# EAGLE design tamiya_camrobo_face_xiao (EAGLE 9.1.3)
CNAME: BotaLab; CREVISION: 1.0; DESIGNER: botamochi6277
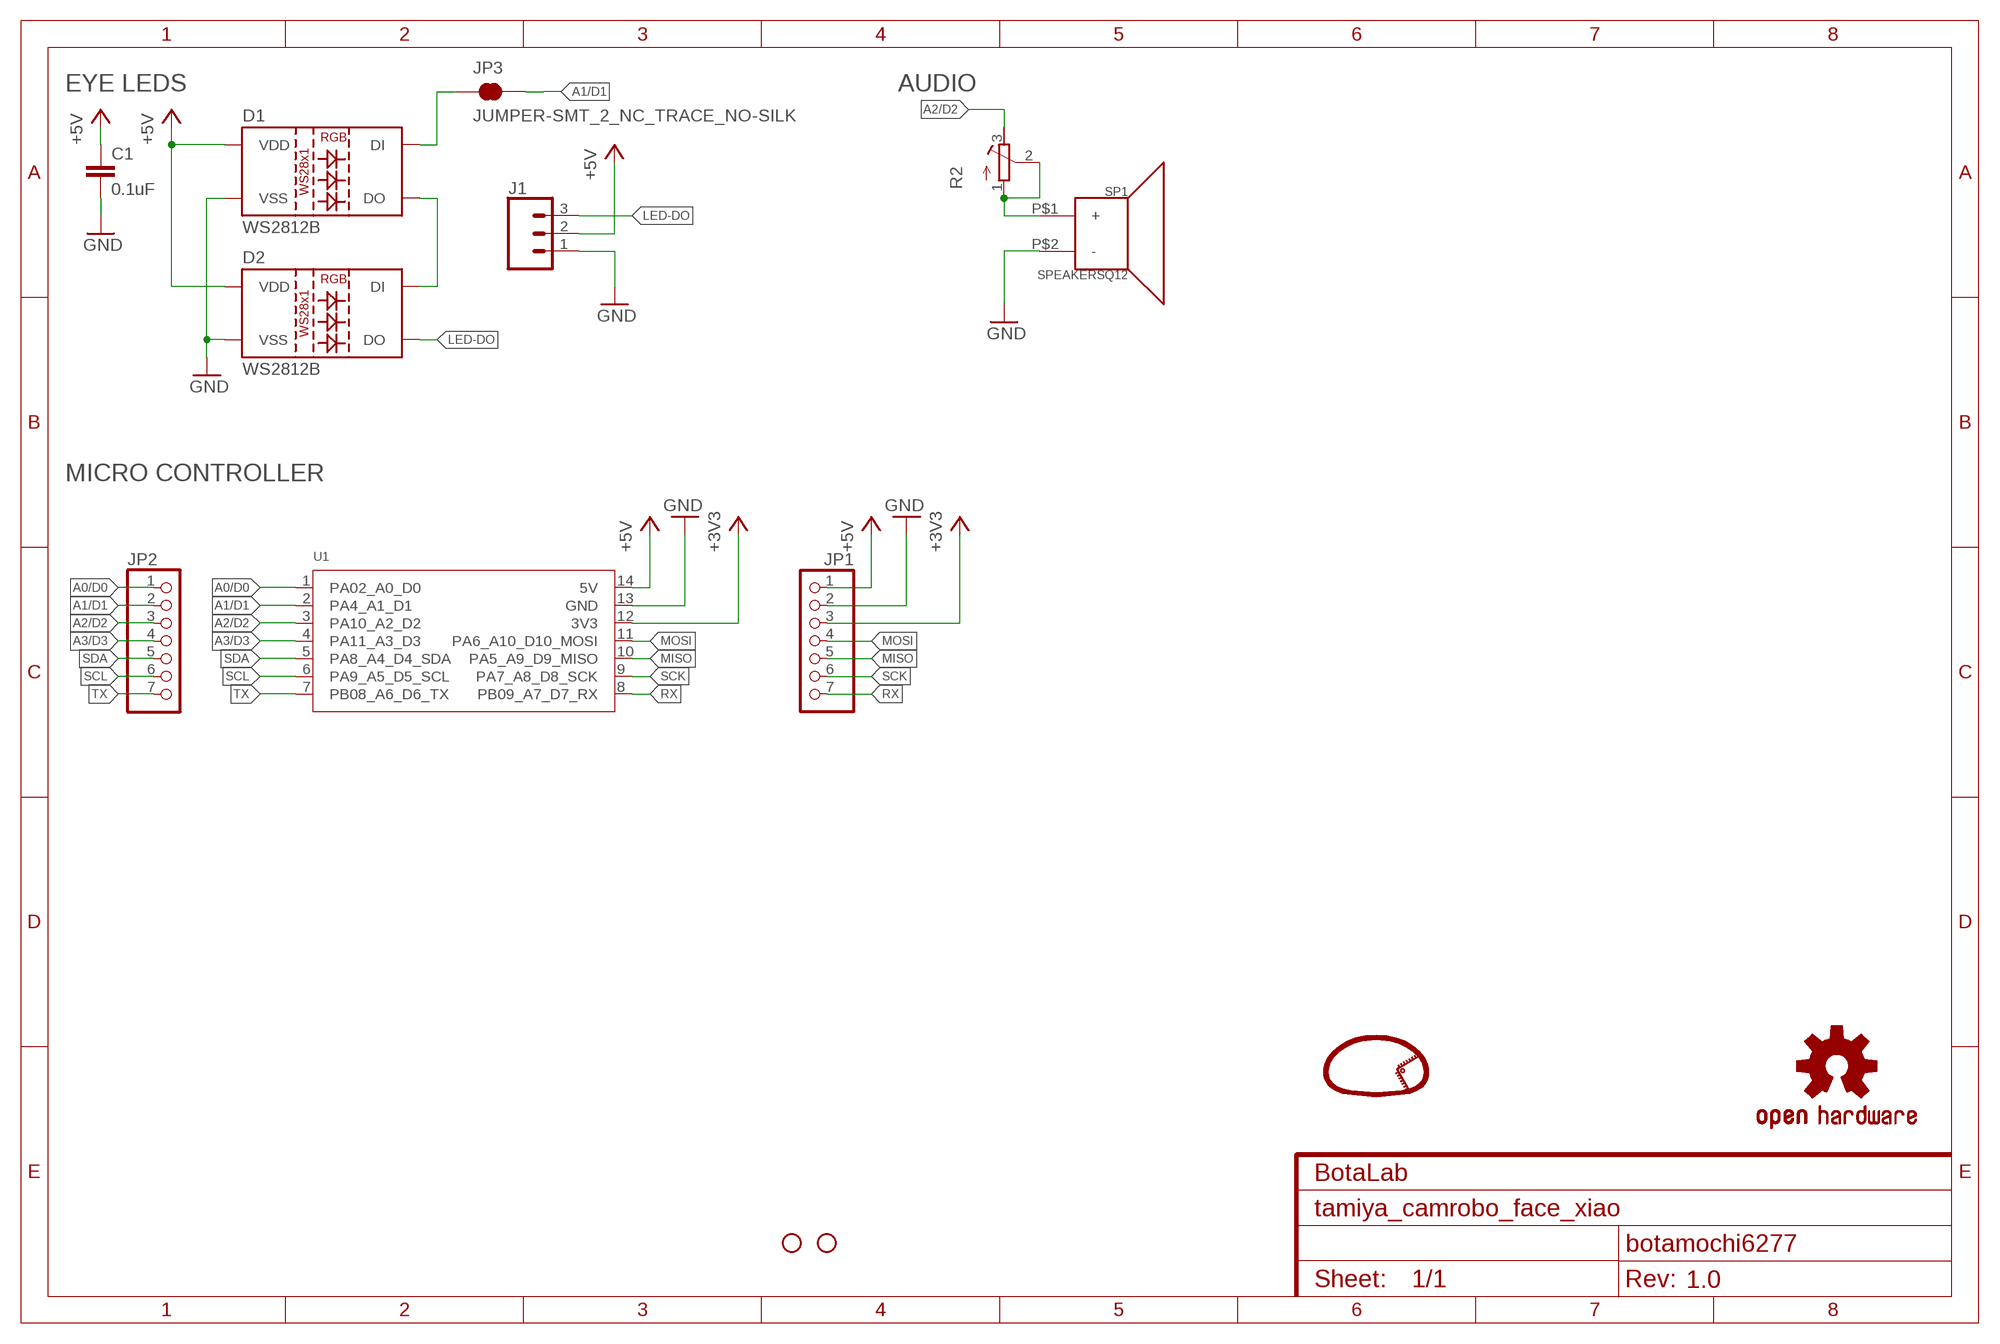
[diagram p0: schematic, sheet 1]

## Parts
C1  0.1uF  C-EUC1608  [C1608]
D1  WS2812B  [WS2812B]
D2  WS2812B  [WS2812B]
H1  STAND-OFF  [STAND-OFF]
H2  STAND-OFF  [STAND-OFF]
J1  CONN_03  [1X03]
JP1  PINHD-1X7  [1X07]
JP2  PINHD-1X7  [1X07]
JP3  JUMPER-SMT_2_NC_TRACE_NO-SILK  [SMT-JUMPER_2_NC_TRACE_NO-SILK]
LOGO1  LOGO  [LOGO]
LOGO2  OSHW-LOGOS  [OSHW-LOGO-S]
R2  R-TRIMMCVR42A  [RTRIMCVR42A]
SP1  SPEAKERSQ12  [PKLCS1212E]
U1  MOUDLE-SEEEDUINO-XIAO-MOUNTED  [MOUDLE14P-2.54-21X17.8MM-MODIFIED]

## Nets
+3V3 [pwr]: JP1.3 U1.12(3V3)
+5V [pwr]: C1.1 D1.1(VDD) D2.1(VDD) J1.2 JP1.1 U1.14(5V)
A0/D0: JP2.1 U1.1(PA02_A0_D0)
A1/D1: JP2.2 JP3.2 U1.2(PA4_A1_D1)
A2/D2: JP2.3 R2.3(E) U1.3(PA10_A2_D2)
A3/D3: JP2.4 U1.4(PA11_A3_D3)
GND [pwr]: C1.2 D1.3(VSS) D2.3(VSS) J1.1 JP1.2 SP1.P$2(-) U1.13(GND)
LED-DO: D2.2(DO) J1.3
MISO: JP1.5 U1.10(PA5_A9_D9_MISO)
MOSI: JP1.4 U1.11(PA6_A10_D10_MOSI)
N$1: D1.2(DO) D2.4(DI)
N$2: R2.1(A) R2.2(S) SP1.P$1(+)
N$3: D1.4(DI) JP3.1
RX: JP1.7 U1.8(PB09_A7_D7_RX)
SCK: JP1.6 U1.9(PA7_A8_D8_SCK)
SCL: JP2.6 U1.6(PA9_A5_D5_SCL)
SDA: JP2.5 U1.5(PA8_A4_D4_SDA)
TX: JP2.7 U1.7(PB08_A6_D6_TX)

## Notes on the sheet
- EYE LEDS | AUDIO
- MICRO CONTROLLER

## Library data of the parts
C1 = rcl:C-EU: CAPACITOR, European symbol; SPICEPREFIX: C
D1 D2 = SparkFun-LED:WS2812B: WS2812B SMD addressable RGB LED 5x5mm SMD LED with built-in controller IC. Color: Red/Green/Blue mC Rating: RGB: 390, 660, 180 mcd Forward Voltage: RGB: 2.0, 3.0, 3.0 V Packages:WS2812B SparkFun Products: Blynk Board - ESP8266 <https://www.sparkfun.com/products/13794>; PROD_ID: DIO-12503
H1 H2 = SparkFun-Hardware:STAND-OFF: Stand Off Drill holes for mechanically mounting via screws, standoffs, etc. Note: Use the keepout ring to avoid running the screw head into surrounding components. Variant Overviews STAND-OFF - Mechanical footprint for a #4 phillips button head screw. STAND-OFF-TIGHT - Mechanical footprint for a #4 phillips button head screw, Example SparkFun Products Screw - Phillips Head (1/4", 4-40, 10 pack) <https://www.sparkfun.com/products/10453> (PRT-10453) Screw - Phillips Head (1/2", 4-40, 10 pack) <https://www.sparkfun.com/products/10452> (PRT-10452) Screw - Phillips Head (3/4", 4-40, 10 pack) <https://www.sparkfun.com/products/10451> (PRT-10451) Screw - Phillips Head (1", 4-40, 10 pack) <https://www.sparkfun.com/products/10450> (PRT-10450)
J1 = SparkFun-Connectors:CONN_03: Multi connection point. Often used as Generic Header-pin footprint for 0.1 inch spaced/style header connections On any of the 0.1 inch spaced packages, you can populate with these: Break Away Headers - Straight <https://www.sparkfun.com/products/116> (PRT-00116) Break Away Male Headers - Right Angle <https://www.sparkfun.com/products/553> (PRT-00553) Female Headers <https://www.sparkfun.com/products/115> (PRT-00115) Break Away Headers - Machine Pin <https://www.sparkfun.com/products/117> (PRT-00117) Break Away Female Headers - Swiss Machine Pin <https://www.sparkfun.com/products/743> (PRT-00743) Stackable Header - 3 Pin (Female, 0.1") <https://www.sparkfun.com/products/13875> (PRT-13875) For SCREWTERMINALS and SPRING TERMINALS visit here: Screw Terimnals on SparkFun.com <https://www.sparkfun.com/search/results?term=Screw+Terminals> (5mm/3.5mm/2.54mm spacing) This device is also useful as a general connection point to wire up your design to another part of your project. Our various solder wires solder well into these plated through hole pads. Hook-Up Wire - Assortment (Stranded, 22 AWG) <https://www.sparkfun.com/products/11375> (PRT-11375) Hook-Up Wire - Assortment (Solid Core, 22 AWG) <https://www.sparkfun.com/products/11367> (PRT-11367) View the entire wire category on our website here <https://www.sparkfun.com/categories/141> Special notes: Molex polarized connector foot print use with SKU : PRT-08232 with associated crimp pins and housings.
JP1 JP2 = pinhead:PINHD-1X7: PIN HEADER
JP3 = SparkFun-Jumpers:JUMPER-SMT_2_NC_TRACE: Normally closed trace jumper This jumper has a trace between two pads so it's normally closed (NC). Use a razor knife to open the connection. For best results follow the IPC guidelines for cutting traces: Cutout at least 0.063 mm (0.005 in). Remove all loose material to clean up the cut area. Seal the cut with an approved epoxy. Reapply solder to reclose the connection.
LOGO1 = botamochi-symbol:LOGO
LOGO2 = SparkFun-Aesthetics:OSHW-LOGO: Open-Source Hardware (OSHW) Logo This logo indicates the piece of hardware it is found on incorporates a OSHW license and/or adheres to the definition of open source hardware found here: http://freedomdefined.org/OSHW
R2 = rcl:R-TRIMM: Trimm resistor; SPICEMODEL: X; SPICEPREFIXL: POT
SP1 = Botamochi-sensors:SPEAKER
U1 = Seeeduino XIAO:MOUDLE-SEEEDUINO-XIAO

## Net classes
1 pwr: width 0.5 mm

## Board
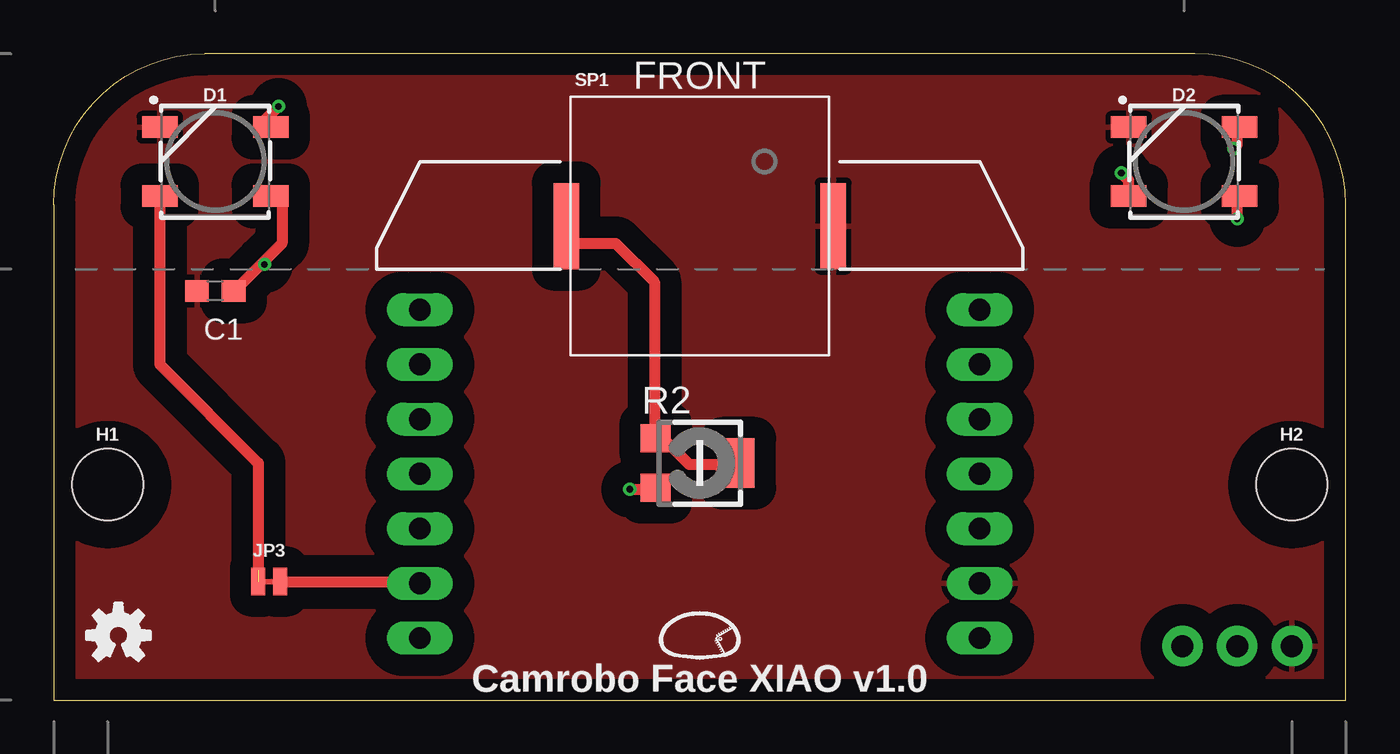
[diagram p1: board, top side]
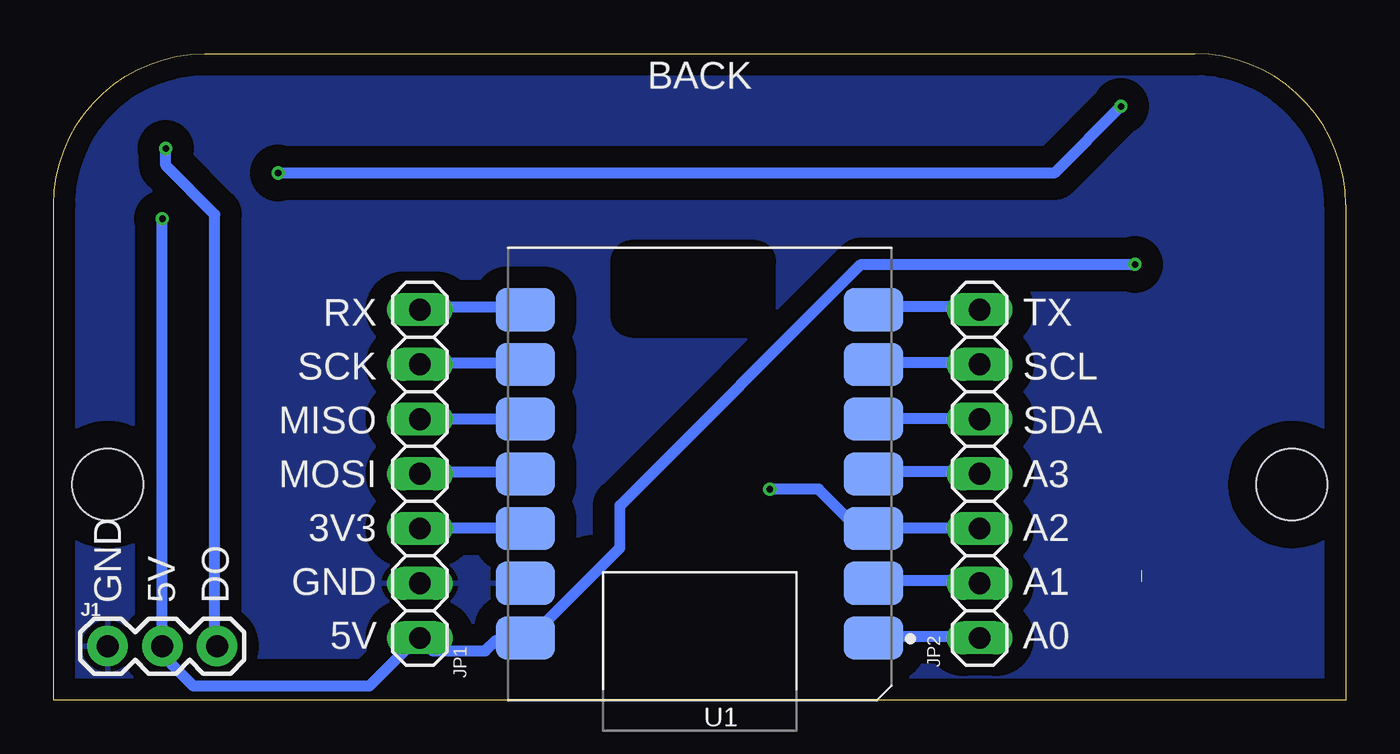
[diagram p2: board, bottom side, seen from below]

Size 60 x 30 mm. Coordinates in mm from the lower left corner, seen from the top.
Outline: 0,0 60,0 60,23 arc90 53,30 7,30 arc90 0,23 0,0
Copper layers (1*16): Top 0.035mm / dielectric 1.5mm / Bottom 0.035mm
Design rules "ssci_SeeedStudio_2layer_DRU_no_angle *": minimum track width 0.5mm, minimum drill 12mil, track to track 6mil, track to pad 6mil, pad to pad 6mil, via to via 6mil, smd to smd 0mil, copper to edge 10mil, drill to drill 10mil, minimum pad ring 10mil, minimum via ring 6mil, stop-mask expansion 2mil, vias tented up to drill 25mil, thermal gap 10mil

### Footprints (pad centres in the part's own frame; a part is rotated, then mirrored left to right if it is on the bottom)
C1608 = smd 1.1 x 1: 1 -0.85,0; 2 0.85,0
WS2812B = smd 1.651 x 1: 1 2.577,-1.6; 2 2.577,1.6; 3 -2.577,1.6; 4 -2.577,-1.6
STAND-OFF = hole 3.302: 0,0
1X03 = drill 1.016 pad 1.88: 1 0,0; 2 2.54,0; 3 5.08,0
1X07 = drill 1.016 long: 1 -7.62,0; 2 -5.08,0; 3 -2.54,0; 4 0,0; 5 2.54,0; 6 5.08,0; 7 7.62,0
SMT-JUMPER_2_NC_TRACE_NO-SILK = smd 0.635 x 1.27: 1 -0.508,0; 2 0.508,0
RTRIMCVR42A = smd 1.3 x 1.4: 1 -1.15,-2.05; 3 1.15,-2.05 | smd 2.3 x 1.5: 2 0,1.8
PKLCS1212E = smd 1.2 x 4: P$1 -6.2,0; P$2 6.2,0
MOUDLE14P-2.54-21X17.8MM-MODIFIED = smd 2.75 x 2: 1 -8.065,-2.88; 2 -8.065,-5.42; 3 -8.065,-7.96; 4 -8.065,-10.5; 5 -8.065,-13.04; 6 -8.065,-15.58; 7 -8.065,-18.12; 8 8.1,-18.12; 9 8.1,-15.58; 10 8.1,-13.04; 11 8.1,-10.5; 12 8.1,-7.96; 13 8.1,-5.42; 14 8.1,-2.88

### Placement (x,y rotation side)
C1  7.5,19 180 top
D1  7.5,25 0 top
D2  52.5,25 0 top
H1  2.5,10 0 top
H2  57.5,10 0 top
J1  57.5,2.5 0 bottom
JP1  43,10.5 90 bottom
JP2  17,10.5 90 bottom
JP3  10,5.5 0 top
LOGO1  30,3 0 top
LOGO2  3,3 0 top
R2  30,11 270 top
SP1  30,22 0 top
U1  30,0 180 bottom

### Tracks (layer width: path | path; a pad name or v marks a point on that pad's centre or on a via)
+3V3
  Bottom 0.5: U1.12 38.16,7.99 42.9,7.99 JP1.3
+5V  (via drill 0.3)
  Top 0.5: v54.97,22.34 54.97,23.32 D2.1 | 9.7,20.31 10.6,21.2 10.6,23.18 10.38,23.4 D1.1 | 9.7,20.31 8.48,19.08 C1.1 | v9.79,20.22 9.7,20.31
  Bottom 0.5: v54.97,22.34 54.97,2.61 J1.2 54.96,2.09 53.51,0.64 45.35,0.64 43.22,2.77 JP1.1 42.9,2.77 42.41,2.28 39.96,2.28 39.47,2.77 38.16,2.77 U1.14 38,2.77 33.71,7.07 33.71,9.02 22.51,20.22 v9.79,20.22
A0/D0
  Bottom 0.5: U1.1 21.86,2.94 17.12,2.94 JP2.1
A1/D1
  Top 0.5: JP3.2 16.92,5.5 JP2.2
  Bottom 0.5: U1.2 21.86,5.54 17.12,5.54 JP2.2
A2/D2  (via drill 0.3)
  Top 0.5: v26.75,9.79 27.89,9.79 R2.3
  Bottom 0.5: v26.75,9.79 24.48,9.79 22.71,8.02 22.75,7.96 U1.3 21.69,7.99 17.12,7.99 JP2.3
A3/D3
  Bottom 0.5: U1.4 21.86,10.6 17.12,10.6 JP2.4
GND
  pour Bottom (isolate 1): 0,30 0,0 60,0 60,30
  pour Top (isolate 1): 0,30 0,0 60,0 60,30
LED-DO  (via drill 0.3)
  Top 0.5: v54.8,25.61 54.97,25.77 54.97,26.59 D2.2
  Bottom 0.5: v54.8,25.61 54.8,24.82 52.52,22.54 52.52,2.61 J1.3
MISO
  Bottom 0.5: U1.10 38.16,13.05 42.9,13.05 JP1.5
MOSI
  Bottom 0.5: U1.11 38.16,10.6 42.9,10.6 JP1.4
N$1  (via drill 0.3)
  Top 0.5: v49.58,24.46 49.91,24.14 49.91,23.49 D2.4 | v10.44,27.56 9.79,26.91 9.79,26.75 9.95,26.59 D1.2
  Bottom 0.5: v49.58,24.46 13.54,24.46 v10.44,27.56
N$2
  Top 0.5: R2.2 31.64,10.93 31.32,10.6 31.15,10.6 30.83,10.93 29.52,10.93 28.38,12.07 28.05,12.07 R2.1 27.89,12.23 27.89,19.41 26.1,21.2 24.3,21.2 23.65,21.86 SP1.P$1
N$3  (1 unrouted)
  Top 0.5: D1.4 4.92,15.58 9.5,11 9.5,6.03
RX
  Bottom 0.5: U1.8 38.16,18.27 42.9,18.27 JP1.7
SCK
  Bottom 0.5: U1.9 38.16,15.66 42.9,15.66 JP1.6
SCL
  Bottom 0.5: U1.6 21.86,15.66 17.12,15.66 JP2.6
SDA
  Bottom 0.5: U1.5 21.86,13.05 17.12,13.05 JP2.5
TX
  Bottom 0.5: U1.7 21.86,18.27 17.12,18.27 JP2.7

### Text on the board
tNames: FRONT | Camrobo Face XIAO v1.0
bNames: BACK | TX | RX | SCL | SCK | SDA | MISO | A3 | MOSI | A2 | 3V3 | A1 | GND | DO | 5V | GND | A0 | 5V